# EAGLE schematic pi_nfc (EAGLE 9.5.0)
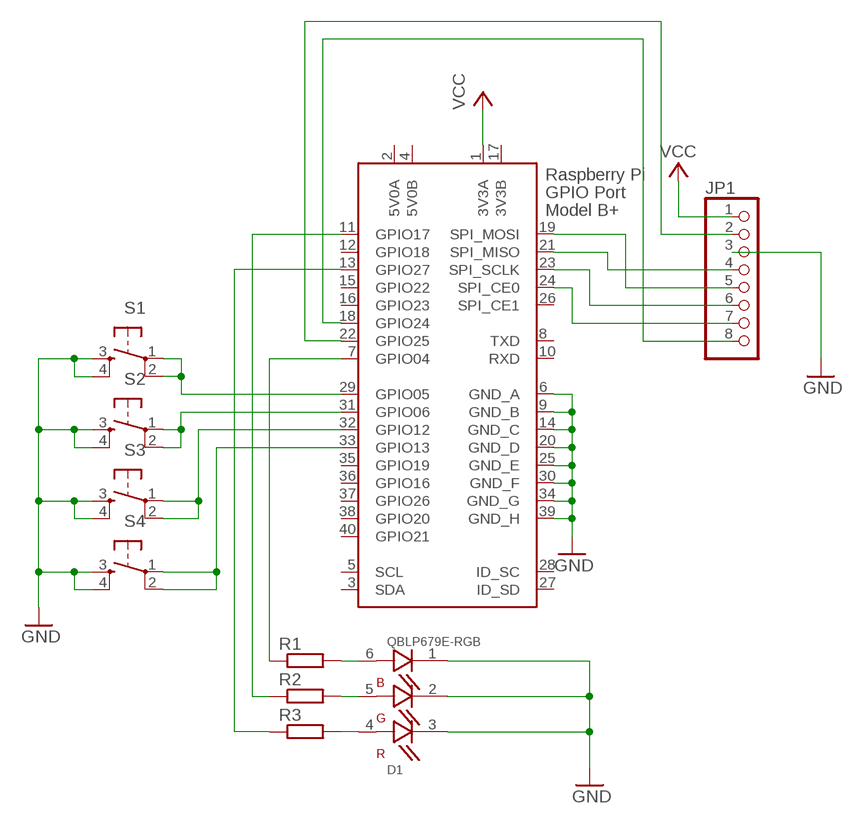
[diagram p0: schematic, sheet 1]

## Parts
D1  QBLP679E-RGB  [LED_QBLP679E-RGB]
JP1  PINHD-1X8  [1X08]
R1  R-EU_M0805  [M0805]
R2  R-EU_M0805  [M0805]
R3  R-EU_M0805  [M0805]
S1  TAC_SWITCHPTH  [TACTILE-PTH]
S2  TAC_SWITCHPTH  [TACTILE-PTH]
S3  TAC_SWITCHPTH  [TACTILE-PTH]
S4  TAC_SWITCHPTH  [TACTILE-PTH]
X1  RASPI_GPIO_B+#_PIN  [RASPI_GPIO_B+_PIN]

## Nets
GND: D1.1(BC) D1.2(GC) D1.3(RC) JP1.3 S1.3 S1.4 S2.3 S2.4 S3.3 S3.4 S4.3 S4.4 X1.6(GND_A) X1.9(GND_B) X1.14(GND_C) X1.20(GND_D) X1.25(GND_E) X1.30(GND_F) X1.34(GND_G) X1.39(GND_H)
N$1: JP1.2 X1.22(GPIO25)
N$2: D1.6(BA) R1.2
N$3: D1.5(GA) R2.2
N$4: D1.4(RA) R3.2
N$5: R1.1 X1.7(GPIO04)
N$6: JP1.4 X1.21(SPI_MISO)
N$7: JP1.5 X1.19(SPI_MOSI)
N$8: JP1.6 X1.23(SPI_SCLK)
N$9: JP1.7 X1.24(SPI_CE0)
N$10: JP1.8 X1.18(GPIO24)
N$11: R2.1 X1.11(GPIO17)
N$12: R3.1 X1.13(GPIO27)
N$13: S1.1 S1.2 X1.29(GPIO05)
N$14: S2.1 S2.2 X1.31(GPIO06)
N$15: S3.1 S3.2 X1.32(GPIO12)
N$16: S4.1 S4.2 X1.33(GPIO13)
VCC: JP1.1 X1.1(3V3A)
Unconnected: X1.3(SDA) X1.5(SCL) X1.8(TXD) X1.10(RXD) X1.12(GPIO18) X1.15(GPIO22) X1.16(GPIO23) X1.26(SPI_CE1) X1.27(ID_SD) X1.28(ID_SC) X1.35(GPIO19) X1.36(GPIO16) X1.37(GPIO26) X1.38(GPIO20) X1.40(GPIO21)

## Power pins joined to a net without a drawn wire
3V3B: X1.17(3V3B)
5V0A: X1.2(5V0A)
5V0B: X1.4(5V0B)

## Library data of the parts
D1 = QBLP679E-RGB:QBLP679E-RGB: LED RGB DIFFUSED 6SMD; DESCRIPTION: Led Rgb Diffused 6smd; DIGI-KEY_PART_NUMBER: 1516-1131-1-ND; DIGI-KEY_PURCHASE_URL: https://www.digikey.nl/product-detail/en/qt-brightek-qtb/QBLP679E-RGB/1516-1131-1-ND/4814858?utm_source=snapeda&utm_medium=aggregator&utm_campaign=symbol; MF: QT Brightek; MP: QBLP679E-RGB; PACKAGE: PLCC-6 QT Brightek
JP1 = pinhead:PINHD-1X8: PIN HEADER
R1-R3 = rcl:R-EU_: RESISTOR, European symbol; SPICEPREFIX: R
S1-S4 = SparkFun-Electromechanical:TAC_SWITCH: Momentary Switch Button commonly used for reset or general input. Spark Fun Electronics SKU : COM-00097 SMT- SWCH-08247
X1 = raspberrypi_bastelstube_v13:RASPI_GPIO_B+#: 2x20 header connector, all pins connected